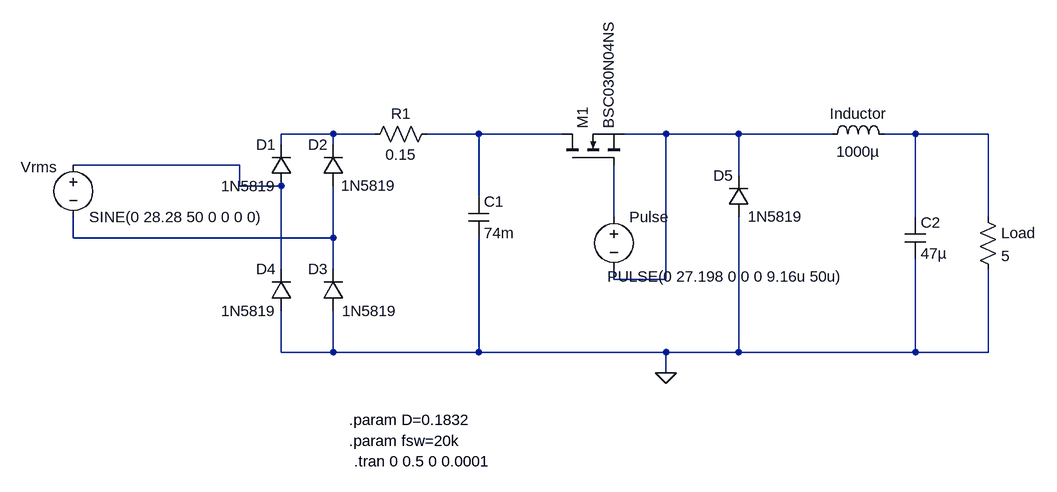
[diagram p0: schematic Buck converter.asc]
Buck converter.asc, the LTspice schematic file:
Version 4
SHEET 1 1452 680
WIRE 272 128 192 128
WIRE 336 128 272 128
WIRE 496 128 416 128
WIRE 624 128 496 128
WIRE 784 128 720 128
WIRE 896 128 784 128
WIRE 1040 128 896 128
WIRE 1168 128 1120 128
WIRE 1280 128 1168 128
WIRE 192 144 192 128
WIRE 272 144 272 128
WIRE 128 176 -128 176
WIRE 896 192 896 128
WIRE 128 208 128 176
WIRE 192 208 128 208
WIRE 496 224 496 128
WIRE 704 256 704 176
WIRE 1168 256 1168 128
WIRE 1280 256 1280 128
WIRE -128 288 -128 256
WIRE 272 288 272 208
WIRE 272 288 -128 288
WIRE 192 336 192 208
WIRE 272 336 272 288
WIRE 704 352 704 336
WIRE 784 352 784 128
WIRE 784 352 704 352
WIRE 192 464 192 400
WIRE 272 464 272 400
WIRE 272 464 192 464
WIRE 496 464 496 288
WIRE 496 464 272 464
WIRE 784 464 496 464
WIRE 896 464 896 256
WIRE 896 464 784 464
WIRE 1168 464 1168 320
WIRE 1168 464 896 464
WIRE 1280 464 1280 336
WIRE 1280 464 1168 464
WIRE 784 496 784 464
FLAG 784 496 0
SYMBOL voltage -128 160 R0
WINDOW 123 0 0 Left 0
WINDOW 39 0 0 Left 0
WINDOW 0 -81 19 Left 2
SYMATTR InstName Vrms
SYMATTR Value SINE(0 28.28 50 0 0 0 0)
SYMBOL cap 480 224 R0
SYMATTR InstName C1
SYMATTR Value 74m
SYMATTR SpiceLine V=35
SYMBOL voltage 704 240 R0
WINDOW 3 -10 107 Left 2
WINDOW 123 0 0 Left 0
WINDOW 39 0 0 Left 0
SYMATTR Value PULSE(0 27.198 0 0 0 9.16u 50u)
SYMATTR InstName Pulse
SYMBOL ind 1024 144 R270
WINDOW 0 32 56 VTop 2
WINDOW 3 5 56 VBottom 2
SYMATTR InstName Inductor
SYMATTR Value 1000µ
SYMATTR SpiceLine Rser=450m
SYMBOL cap 1152 256 R0
SYMATTR InstName C2
SYMATTR Value 47µ
SYMATTR SpiceLine V=10
SYMBOL res 1264 240 R0
SYMATTR InstName Load
SYMATTR Value 5
SYMBOL nmos 624 176 R270
SYMATTR InstName M1
SYMATTR Value BSC030N04NS
SYMBOL diode 208 208 R180
WINDOW 0 24 64 Left 2
WINDOW 3 24 0 Left 2
SYMATTR InstName D1
SYMATTR Value 1N5819
SYMBOL diode 288 208 R180
WINDOW 0 24 64 Left 2
WINDOW 3 -81 1 Left 2
SYMATTR InstName D2
SYMATTR Value 1N5819
SYMBOL diode 288 400 R180
WINDOW 0 24 64 Left 2
WINDOW 3 -82 0 Left 2
SYMATTR InstName D3
SYMATTR Value 1N5819
SYMBOL diode 208 400 R180
WINDOW 0 24 64 Left 2
WINDOW 3 24 0 Left 2
SYMATTR InstName D4
SYMATTR Value 1N5819
SYMBOL diode 912 256 R180
WINDOW 0 24 64 Left 2
WINDOW 3 -83 1 Left 2
SYMATTR InstName D5
SYMATTR Value 1N5819
SYMBOL res 432 112 R90
WINDOW 0 0 56 VBottom 2
WINDOW 3 32 56 VTop 2
SYMATTR InstName R1
SYMATTR Value 0.15
TEXT 296 568 Left 2 !.param D=0.1832
TEXT 296 600 Left 2 !.param fsw=20k
TEXT 304 632 Left 2 !.tran 0 0.5 0 0.0001

The netlist it stands for:
* Buck converter.asc
Vrms N005 N007 SINE(0 28.28 50 0 0 0 0)
C1 N002 0 74m V=35
V§Pulse N006 N003 PULSE(0 27.198 0 0 0 9.16u 50u)
L§Inductor N003 N004 1000µ Rser=450m
C2 N004 0 47µ V=10
R§Load N004 0 5
M1 N002 N006 N003 N003 BSC030N04NS
D1 N005 N001 1N5819
D2 N007 N001 1N5819
D3 0 N007 1N5819
D4 0 N005 1N5819
D5 0 N003 1N5819
R1 N002 N001 0.15
.model D D
.lib standard.dio
.model NMOS NMOS
.model PMOS PMOS
.lib standard.mos
.param D=0.1832
.param fsw=20k
.tran 0 0.5 0 0.0001
.backanno
.end